# Altium project DistributedMicrocontrollersCopy.PrjPcb
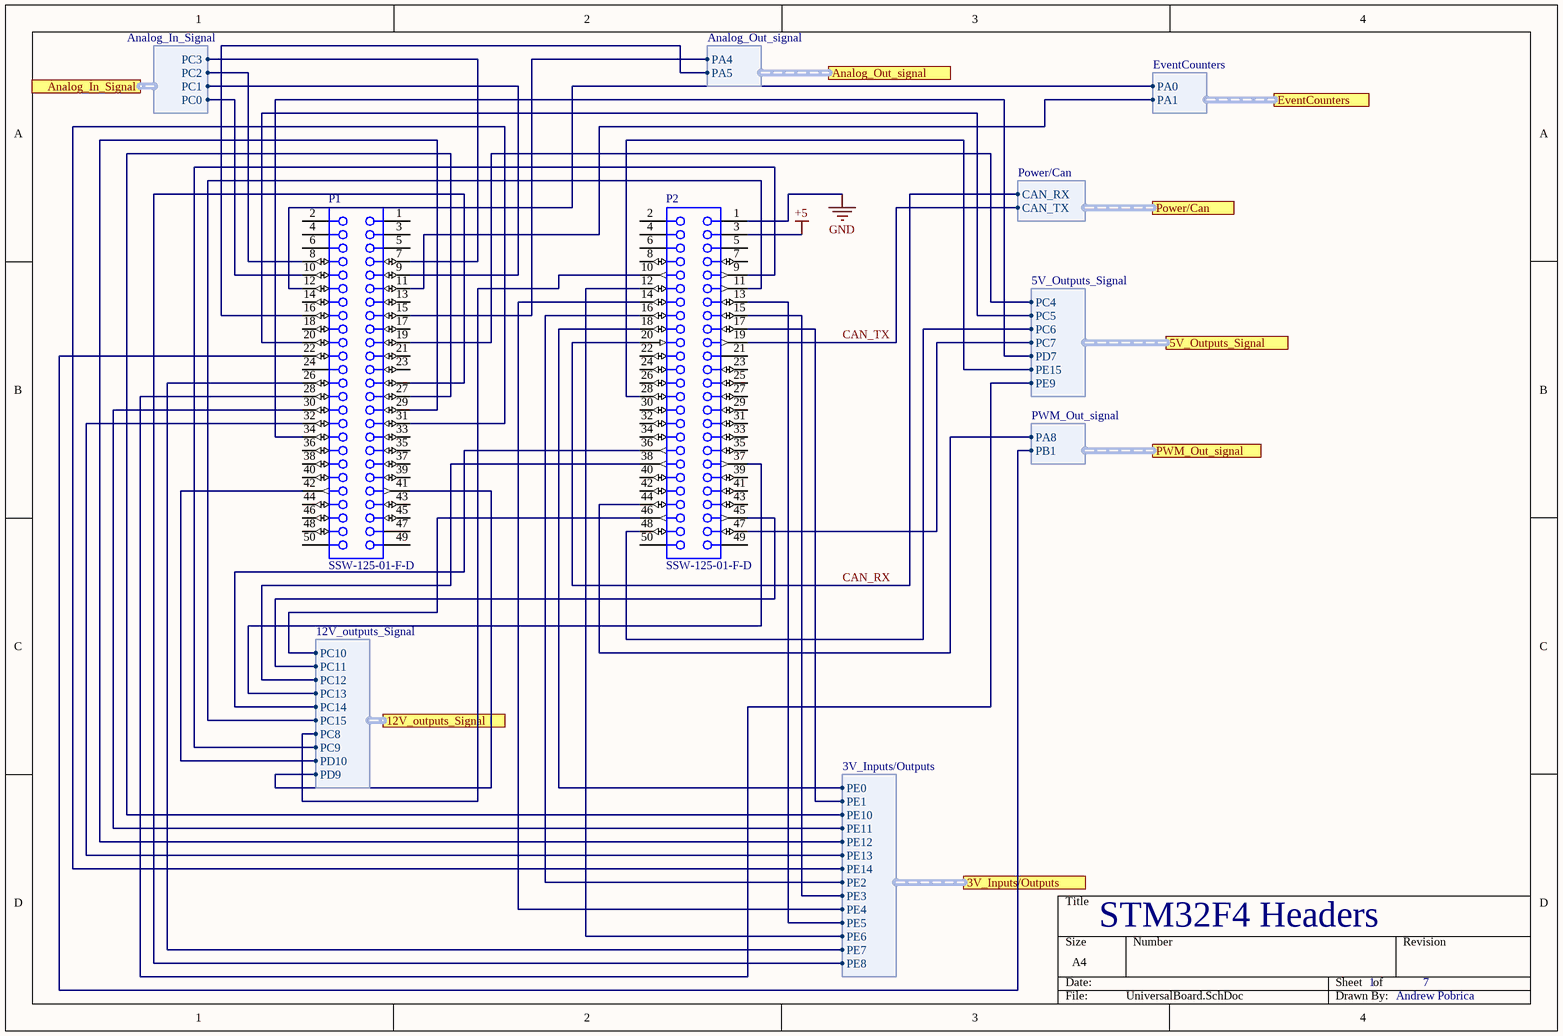
[diagram p0: UniversalBoard.SchDoc]
7 sheets, 75 parts. Net scope: flat (ports and power ports of the same name join across sheets).
Board file: UniversalBoard.PcbDoc
Sheets:
  UniversalBoard.SchDoc
  12vOutputs.SchDoc
  output_header.SchDoc
  Power_CAN.SchDoc
  5vOutputs.SchDoc
  DAC_PWW_Outputs.SchDoc
  Analog_inputs.SchDoc

## Sheet UniversalBoard.SchDoc: STM32F4 Headers
size A4; Author: Andrew Pobrica; DrawnBy: Andrew Pobrica; DocumentNumber: 1; SheetNumber: 1; SheetTotal: 7

### Parts
P1  SSW-125-01-F-D  [SMTC-SSW-125-01-X-D]
P2  SSW-125-01-F-D  [SMTC-SSW-125-01-X-D]

### Ports
3V_Inputs/Outputs (harness 3V_Inputs/Outputs), 5V_Outputs_Signal (harness 5V_Outputs_Signal), 12V_outputs_Signal (harness 12V_outputs_Signal), Analog_In_Signal (harness Analog_In_Signal), Analog_Out_signal (harness Analog_Out_signal), EventCounters (harness EventCounters), Power/Can (harness Power/Can), PWM_Out_signal (harness PWM_Out_signal)

### Harnesses
Power/Can: CAN_RX, CAN_TX
PWM_Out_signal: PA8, PB1
5V_Outputs_Signal: PC4, PC5, PC6, PC7, PD7, PE15, PE9
Analog_In_Signal: PC0, PC1, PC2, PC3
12V_outputs_Signal: PC10, PC11, PC12, PC13, PC14, PC15, PC8, PC9, PD10, PD9
Analog_Out_signal: PA4, PA5
3V_Inputs/Outputs: PE0, PE1, PE10, PE11, PE12, PE13, PE14, PE2, PE3, PE4, PE5, PE6, PE7, PE8
EventCounters: PA0, PA1

### Nets
+5: P2.3(5V)
GND: P2.1(GND)
CAN_RX: P2.20(PB8) ; port Power/Can.CAN_RX
CAN_TX: P2.19(PB9) ; port Power/Can.CAN_TX
NetP1_7: P1.7(PC0) ; port Analog_In_Signal.PC3
NetP1_8: P1.8(PC1) ; port Analog_In_Signal.PC2
NetP1_9: P1.9(PC2) ; port Analog_In_Signal.PC1
NetP1_10: P1.10(PC3) ; port Analog_In_Signal.PC0
NetP1_11: P1.11(PA0) ; port EventCounters.PA1
NetP1_12: P1.12(PA1) ; port EventCounters.PA0
NetP1_15: P1.15(PA4) ; port Analog_Out_signal.PA4
NetP1_16: P1.16(PA5) ; port Analog_Out_signal.PA5
NetP1_19: P1.19(PC4) ; port 5V_Outputs_Signal.PC4
NetP1_20: P1.20(PC5) ; port 5V_Outputs_Signal.PC5
NetP1_22: P1.22(PB1) ; port PWM_Out_signal.PB1
NetP1_25: P1.25(PE8) ; port 3V_Inputs/Outputs.PE8
NetP1_26: P1.26(PE7) ; port 3V_Inputs/Outputs.PE7
NetP1_27: P1.27(PE10) ; port 3V_Inputs/Outputs.PE10
NetP1_28: P1.28(PE9) ; port 5V_Outputs_Signal.PE9
NetP1_29: P1.29(PE12) ; port 3V_Inputs/Outputs.PE12
NetP1_30: P1.30(PE11) ; port 3V_Inputs/Outputs.PE11
NetP1_31: P1.31(PE14) ; port 3V_Inputs/Outputs.PE14
NetP1_32: P1.32(PE13) ; port 3V_Inputs/Outputs.PE13
NetP1_34: P1.34(PE15) ; port 5V_Outputs_Signal.PD7
NetP1_41: P1.41(PD10) ; port 12V_outputs_Signal.PD9
NetP1_42: P1.42(PD9) ; port 12V_outputs_Signal.PD10
NetP2_9: P2.9(PC15) ; port 12V_outputs_Signal.PC9
NetP2_10: P2.10(PC14) ; port 12V_outputs_Signal.PC8
NetP2_11: P2.11(PC13) ; port 12V_outputs_Signal.PC15
NetP2_12: P2.12(PE6) ; port 3V_Inputs/Outputs.PE6
NetP2_13: P2.13(PE5) ; port 3V_Inputs/Outputs.PE5
NetP2_14: P2.14(PE4) ; port 3V_Inputs/Outputs.PE4
NetP2_15: P2.15(PE3) ; port 3V_Inputs/Outputs.PE3
NetP2_16: P2.16(PE2) ; port 3V_Inputs/Outputs.PE2
NetP2_17: P2.17(PE1) ; port 3V_Inputs/Outputs.PE1
NetP2_18: P2.18(PE0) ; port 3V_Inputs/Outputs.PE0
NetP2_28: P2.28(PD7) ; port 5V_Outputs_Signal.PE15
NetP2_36: P2.36(PC12) ; port 12V_outputs_Signal.PC14
NetP2_37: P2.37(PC11) ; port 12V_outputs_Signal.PC13
NetP2_38: P2.38(PC10) ; port 12V_outputs_Signal.PC12
NetP2_44: P2.44(PA8) ; port PWM_Out_signal.PA8
NetP2_45: P2.45(PC9) ; port 12V_outputs_Signal.PC11
NetP2_46: P2.46(PC8) ; port 12V_outputs_Signal.PC10
NetP2_47: P2.47(PC7) ; port 5V_Outputs_Signal.PC7
NetP2_48: P2.48(PC6) ; port 5V_Outputs_Signal.PC6

Not connected (* = marked no-connect by the designer): P1 1(GND) 2(GND) 3(VDD) 4(VDD) 5(NRST) 6(GND) 13(PA2) 14(PA3) 17(PA6) 18(PA7) 21(PB0) 23(PB2) 24(GND) 33(PB10) 35(PB12) 36(PB11) 37(PB14) 38(PB13) 39(PD8) 40(PB15) 43(PD12) 44(PD11) 45(PD14) 46(PD13) 47(NC) 48(PD15) 49(GND) 50(GND); P2 2(GND) 4(5V) 5(3V) 6(3V) 7(PH1) 8(PH0) 21(VDD) 22(BOOT0) 23(PB7) 24(PB6) 25(PB5) 26(PB4) 27(PB3) 29(PD6) 30(PD5) 31(PD4) 32(PD3) 33(PD2) 34(PD1) 35(PD0) 39(PA15) 40(PA14) 41(PA13) 42(PA10) 43(PA9) 49(GND) 50(GND)

### Library data of the parts
P1 P2 = CMP-1023-00476-1: SQ Post Socket, Through-hole, Vertical, -55 to 125 degC, 2.54 mm Pitch, 50-Pin, Female, RoHS; Manufacturer: Samtec; Pitch: 2.54 mm; PackageReference: SSW-125-01-X-D; RoHS: True; ComponentLink1Description: Manufacturer URL; Temperature Range: -55 to 125 degC; ComponentLink3URL: http://www.samtec.com/documents/webfiles/cpdf/SSW-1XX-XX-XXX-X-XX-XXX-XX-MKT.pdf; ComponentLink2URL: http://www.samtec.com/documents/webfiles/pdf/SSW_TH.PDF; PartNumber: SSW-125-01-F-D; PackageDescription: Assembly, Socket Strip .016 X .031 Tail; ComponentLink1URL: http://www.samtec.com; DatasheetVersion: F-214; PackageVersion: CA, 6/1987; ComponentLink2Description: Datasheet; Mounting Technology: Through-hole; Orientation: Vertical; ComponentLink3Description: Package Specification

## Sheet 12vOutputs.SchDoc: 12V Outputs
size A; DrawnBy: Andrew Pobrica; DocumentNumber: 2; SheetNumber: 2; SheetTotal: 7
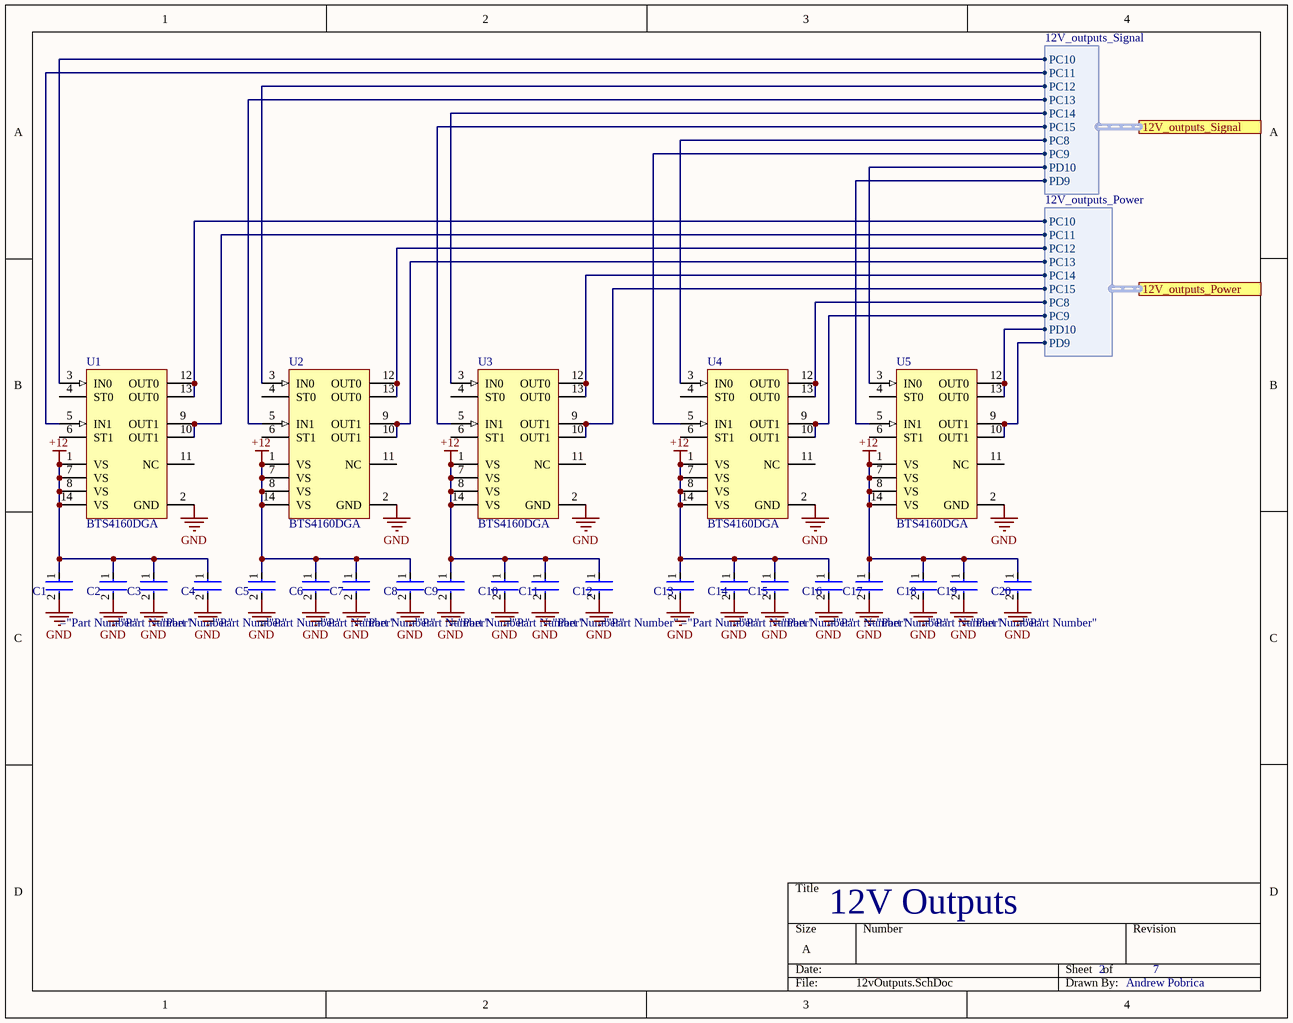
[diagram p1: 12vOutputs.SchDoc]

### Parts
C1  C0603C104K5RACTU  [Kemet_C0805_IPC_A]  (value not drawn)
C2  C0603C104K5RACTU  [Kemet_C0805_IPC_A]  (value not drawn)
C3  C0603C104K5RACTU  [Kemet_C0805_IPC_A]  (value not drawn)
C4  C0603C104K5RACTU  [Kemet_C0805_IPC_A]  (value not drawn)
C5  C0603C104K5RACTU  [Kemet_C0805_IPC_A]  (value not drawn)
C6  C0603C104K5RACTU  [Kemet_C0805_IPC_A]  (value not drawn)
C7  C0603C104K5RACTU  [Kemet_C0805_IPC_A]  (value not drawn)
C8  C0603C104K5RACTU  [Kemet_C0805_IPC_A]  (value not drawn)
C9  C0603C104K5RACTU  [Kemet_C0805_IPC_A]  (value not drawn)
C10  C0603C104K5RACTU  [Kemet_C0805_IPC_A]  (value not drawn)
C11  C0603C104K5RACTU  [Kemet_C0805_IPC_A]  (value not drawn)
C12  C0603C104K5RACTU  [Kemet_C0805_IPC_A]  (value not drawn)
C13  C0603C104K5RACTU  [Kemet_C0805_IPC_A]  (value not drawn)
C14  C0603C104K5RACTU  [Kemet_C0805_IPC_A]  (value not drawn)
C15  C0603C104K5RACTU  [Kemet_C0805_IPC_A]  (value not drawn)
C16  C0603C104K5RACTU  [Kemet_C0805_IPC_A]  (value not drawn)
C17  C0603C104K5RACTU  [Kemet_C0805_IPC_A]  (value not drawn)
C18  C0603C104K5RACTU  [Kemet_C0805_IPC_A]  (value not drawn)
C19  C0603C104K5RACTU  [Kemet_C0805_IPC_A]  (value not drawn)
C20  C0603C104K5RACTU  [Kemet_C0805_IPC_A]  (value not drawn)
U1  BTS4160DGA  [INF-PG-DSO-14-37_N]
U2  BTS4160DGA  [INF-PG-DSO-14-37_N]
U3  BTS4160DGA  [INF-PG-DSO-14-37_N]
U4  BTS4160DGA  [INF-PG-DSO-14-37_N]
U5  BTS4160DGA  [INF-PG-DSO-14-37_N]

### Ports
12V_outputs_Power (harness 12V_outputs_Power), 12V_outputs_Signal (harness 12V_outputs_Signal)

### Harnesses
12V_outputs_Power: PC10, PC11, PC12, PC13, PC14, PC15, PC8, PC9, PD10, PD9
12V_outputs_Signal: PC10, PC11, PC12, PC13, PC14, PC15, PC8, PC9, PD10, PD9

### Nets
+12: C1.1 C2.1 C3.1 C4.1 C5.1 C6.1 C7.1 C8.1 C9.1 C10.1 C11.1 C12.1 C13.1 C14.1 C15.1 C16.1 C17.1 C18.1 C19.1 C20.1 U1.1(VS) U1.7(VS) U1.8(VS) U1.14(VS) U2.1(VS) U2.7(VS) U2.8(VS) U2.14(VS) U3.1(VS) U3.7(VS) U3.8(VS) U3.14(VS) U4.1(VS) U4.7(VS) U4.8(VS) U4.14(VS) U5.1(VS) U5.7(VS) U5.8(VS) U5.14(VS)
GND: C1.2 C2.2 C3.2 C4.2 C5.2 C6.2 C7.2 C8.2 C9.2 C10.2 C11.2 C12.2 C13.2 C14.2 C15.2 C16.2 C17.2 C18.2 C19.2 C20.2 U1.2(GND) U2.2(GND) U3.2(GND) U4.2(GND) U5.2(GND)
NetP1_41: U5.5(IN1) ; port 12V_outputs_Signal.PD9
NetP1_42: U5.3(IN0) ; port 12V_outputs_Signal.PD10
NetP2_9: U4.5(IN1) ; port 12V_outputs_Signal.PC9
NetP2_10: U4.3(IN0) ; port 12V_outputs_Signal.PC8
NetP2_11: U3.5(IN1) ; port 12V_outputs_Signal.PC15
NetP2_36: U3.3(IN0) ; port 12V_outputs_Signal.PC14
NetP2_37: U2.5(IN1) ; port 12V_outputs_Signal.PC13
NetP2_38: U2.3(IN0) ; port 12V_outputs_Signal.PC12
NetP2_45: U1.5(IN1) ; port 12V_outputs_Signal.PC11
NetP2_46: U1.3(IN0) ; port 12V_outputs_Signal.PC10
NetP3_2: U1.9(OUT1) U1.10(OUT1) ; port 12V_outputs_Power.PC11
NetP3_3: U2.9(OUT1) U2.10(OUT1) ; port 12V_outputs_Power.PC13
NetP3_4: U3.9(OUT1) U3.10(OUT1) ; port 12V_outputs_Power.PC15
NetP3_5: U4.9(OUT1) U4.10(OUT1) ; port 12V_outputs_Power.PC9
NetP3_6: U5.9(OUT1) U5.10(OUT1) ; port 12V_outputs_Power.PD9
NetP3_36: U1.12(OUT0) U1.13(OUT0) ; port 12V_outputs_Power.PC10
NetP3_37: U2.12(OUT0) U2.13(OUT0) ; port 12V_outputs_Power.PC12
NetP3_38: U3.12(OUT0) U3.13(OUT0) ; port 12V_outputs_Power.PC14
NetP3_39: U4.12(OUT0) U4.13(OUT0) ; port 12V_outputs_Power.PC8
NetP3_40: U5.12(OUT0) U5.13(OUT0) ; port 12V_outputs_Power.PD10

Not connected (* = marked no-connect by the designer): U1 4(ST0) 6(ST1) 11(NC); U2 4(ST0) 6(ST1) 11(NC); U3 4(ST0) 6(ST1) 11(NC); U4 4(ST0) 6(ST1) 11(NC); U5 4(ST0) 6(ST1) 11(NC)

### Library data of the parts
U1-U5 = BTS4160DGA: Smart High-Side Power Switch, 2 Channels, 1.7 A Load Current, -40 to 150 degC, PG-DSO-14-37, Reel, Green; Manufacturer: Infineon; Group: Automotive Qualified; RON(max) @ 150degreesC: 320 mOhm; Recommended Operating Voltage Min.: 5.5 V; Recommended Operating Voltage Max.: 20 V; Green: TRUE; toff (max): 270 us; Load Current (typ): 1.7 A; ton (max): 250 us; RON @ 25degreesC: 160 mOhm; Ptot (max): 1.4 W; Channels: 2; PartNumber: BTS4160DGA; ComponentLink1Description: Manufacturer URL; ComponentLink2Description: Datasheet; DatasheetVersion: Rev. 1.0; ComponentLink3URL: http://www.infineon.com/dgdl/BTS723GWDS11_2007_09_25.pdf?folderId=db3a304314dca389011537739e37155f&fileId=db3a304331c8f8560131dbfec21b0da9&sId=db3a30443d67b5ca013d854df2f133e5; ComponentLink1URL: http://www.infineon.com/; Packing: Reel; ComponentLink2URL: http://www.infineon.com/dgdl/BTS+4160DGA_DS2008_03_18_neu.pdf?folderId=db3a304314dca389011537739e37155f&fileId=db3a30431a5c32f2011a957ab5875685&sId=db3a30433d68e984013d7cba76cc57cb; ComponentLink3Description: Package Specification; PackageVersion: Sep-07; Halogen-free: TRUE; Mounting Technology: Surface Mount; PackageReference: PG-DSO-14-37; PackageDescription: 14-Pin Plastic (Green) Dual Small Outline Package, 8.65 x 3.9 mm Body, 1.27 mm Pitch

## Sheet output_header.SchDoc: Output Header
size A; DrawnBy: Andrew Pobrica; DocumentNumber: 3; SheetNumber: 3; SheetTotal: 7
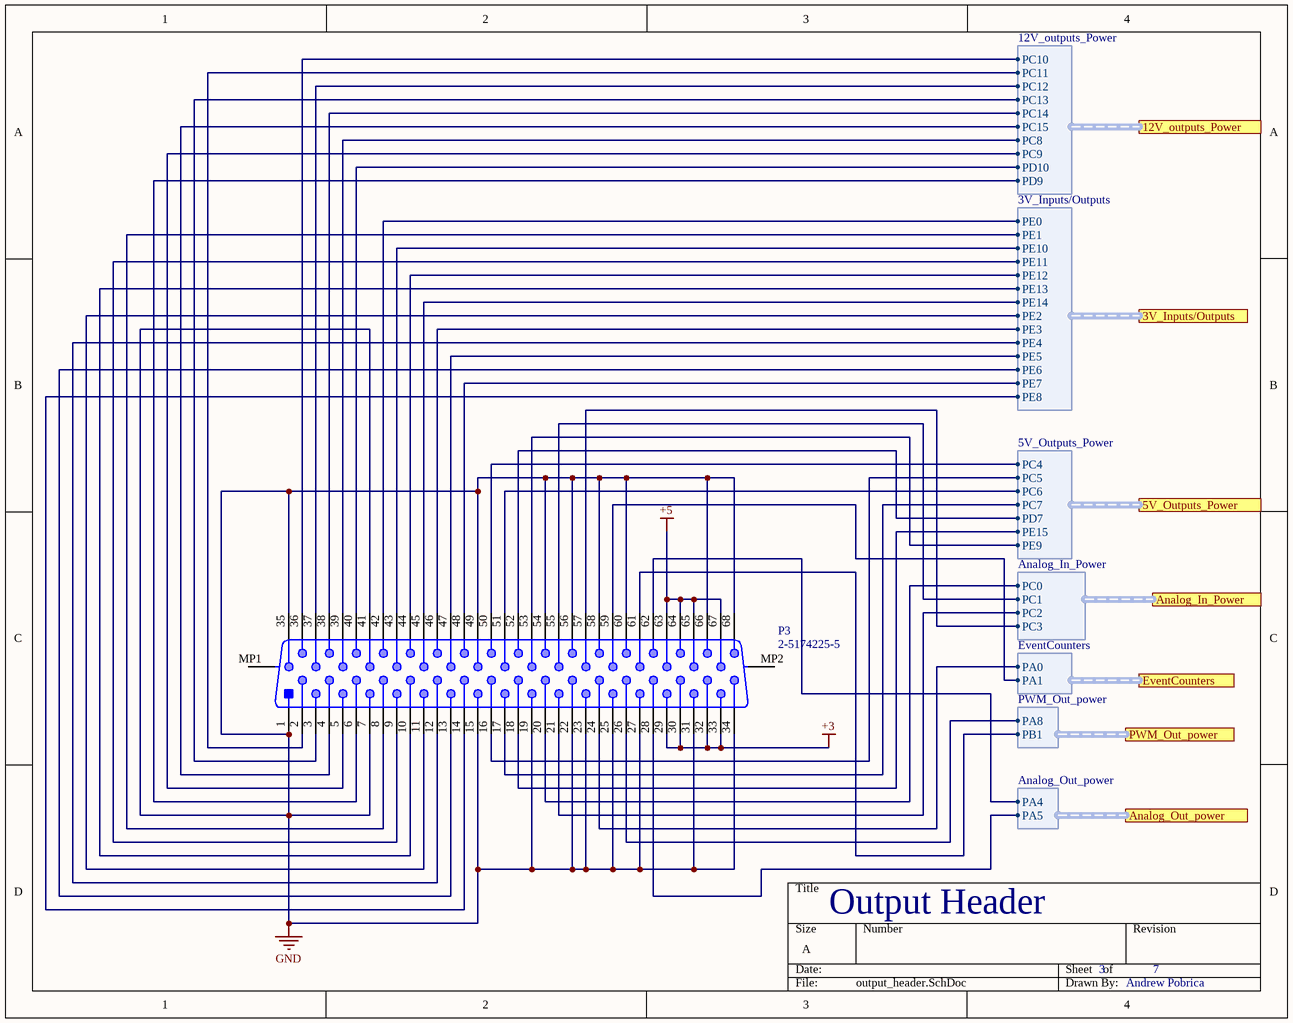
[diagram p2: output_header.SchDoc]

### Parts
P3  2-5174225-5  [TECO-2-5174225-5-68_V]

### Ports
3V_Inputs/Outputs (harness 3V_Inputs/Outputs), 5V_Outputs_Power (harness 5V_Outputs_Power), 12V_outputs_Power (harness 12V_outputs_Power), Analog_In_Power (harness Analog_In_Power), Analog_Out_power (harness Analog_Out_power), EventCounters (harness EventCounters), PWM_Out_power (harness PWM_Out_power)

### Harnesses
12V_outputs_Power: PC10, PC11, PC12, PC13, PC14, PC15, PC8, PC9, PD10, PD9
5V_Outputs_Power: PC4, PC5, PC6, PC7, PD7, PE15, PE9
EventCounters: PA0, PA1
3V_Inputs/Outputs: PE0, PE1, PE10, PE11, PE12, PE13, PE14, PE2, PE3, PE4, PE5, PE6, PE7, PE8
Analog_In_Power: PC0, PC1, PC2, PC3
PWM_Out_power: PA8, PB1
Analog_Out_power: PA4, PA5

### Nets
+3: P3.29 P3.30 P3.32 P3.33
+5: P3.63 P3.64 P3.65 P3.67
GND: P3.1 P3.7 P3.15 P3.19 P3.22 P3.23 P3.25 P3.27 P3.31 P3.34 P3.35 P3.41 P3.49 P3.54 P3.56 P3.58 P3.60 P3.66 P3.68
NetP1_11: P3.59 ; port EventCounters.PA1
NetP1_12: P3.24 ; port EventCounters.PA0
NetP1_25: P3.14 ; port 3V_Inputs/Outputs.PE8
NetP1_26: P3.48 ; port 3V_Inputs/Outputs.PE7
NetP1_27: P3.43 ; port 3V_Inputs/Outputs.PE10
NetP1_29: P3.44 ; port 3V_Inputs/Outputs.PE12
NetP1_30: P3.9 ; port 3V_Inputs/Outputs.PE11
NetP1_31: P3.45 ; port 3V_Inputs/Outputs.PE14
NetP1_32: P3.10 ; port 3V_Inputs/Outputs.PE13
NetP2_12: P3.13 ; port 3V_Inputs/Outputs.PE6
NetP2_13: P3.47 ; port 3V_Inputs/Outputs.PE5
NetP2_14: P3.12 ; port 3V_Inputs/Outputs.PE4
NetP2_15: P3.46 ; port 3V_Inputs/Outputs.PE3
NetP2_16: P3.11 ; port 3V_Inputs/Outputs.PE2
NetP2_17: P3.8 ; port 3V_Inputs/Outputs.PE1
NetP2_18: P3.42 ; port 3V_Inputs/Outputs.PE0
NetP3_2: P3.2 ; port 12V_outputs_Power.PC11
NetP3_3: P3.3 ; port 12V_outputs_Power.PC13
NetP3_4: P3.4 ; port 12V_outputs_Power.PC15
NetP3_5: P3.5 ; port 12V_outputs_Power.PC9
NetP3_6: P3.6 ; port 12V_outputs_Power.PD9
NetP3_16: P3.16 ; port 5V_Outputs_Power.PC5
NetP3_17: P3.17 ; port 5V_Outputs_Power.PC7
NetP3_18: P3.18 ; port 5V_Outputs_Power.PE15
NetP3_20: P3.20 ; port Analog_In_Power.PC0
NetP3_21: P3.21 ; port Analog_In_Power.PC2
NetP3_26: P3.26 ; port PWM_Out_power.PA8
NetP3_28: P3.28 ; port Analog_Out_power.PA5
NetP3_36: P3.36 ; port 12V_outputs_Power.PC10
NetP3_37: P3.37 ; port 12V_outputs_Power.PC12
NetP3_38: P3.38 ; port 12V_outputs_Power.PC14
NetP3_39: P3.39 ; port 12V_outputs_Power.PC8
NetP3_40: P3.40 ; port 12V_outputs_Power.PD10
NetP3_50: P3.50 ; port 5V_Outputs_Power.PC4
NetP3_51: P3.51 ; port 5V_Outputs_Power.PC6
NetP3_52: P3.52 ; port 5V_Outputs_Power.PD7
NetP3_53: P3.53 ; port 5V_Outputs_Power.PE9
NetP3_55: P3.55 ; port Analog_In_Power.PC1
NetP3_57: P3.57 ; port Analog_In_Power.PC3
NetP3_61: P3.61 ; port PWM_Out_power.PB1
NetP3_62: P3.62 ; port Analog_Out_power.PA4

Not connected (* = marked no-connect by the designer): P3 MP1 MP2

### Library data of the parts
P3 = CMP-2000-05410-1: Male D-Sub Connector, Pitch 1.27 mm, 2 x 34 Position, Height 10.3 mm, Tail Length 2.1 mm, -55 to 85 degC, RoHS, Tray; Manufacturer: TE Connectivity; Other Names: A33476; Featured Product: AMPLIMITED-SubminiatureConnectors; 3D Model: 2-5174225-5.pdf; Flange Feature: Housing/Shell(M2.5);Latchblocks; Voltage Rating: 100V; Product Training Modules: AMPLIMITED-SubConnectors; Dynamic Catalog: AMPLIMITE.050IISeries; Connector Type: Cap,MalePins; Connector Style: D-Type; Number of Positions: 68; Current Rating: 1A; Package Version: Rev. C1, 03/2011; Manufacturer URL: http://www.te.com/; Termination: Solder; Datasheet URL: http://www.te.com.cn/commerce/DocumentDelivery/DDEController?Action=showdoc&DocId=Customer+Drawing%7F5174225%7FC1%7Fpdf%7FEnglish%7FENG_CD_5174225_C1.pdf%7F2-5174225-5; Category: Connectors,Interconnects; Series: AMPLIMITE.050II; Shell Material, Finish: Zinc,NickelPlated; Housing Material: PolybutyleneTerephthalate(PBT); Family: D-SubConnectors; Package Reference: 2-5174225-5-68; Package URL: http://www.te.com.cn/commerce/DocumentDelivery/DDEController?Action=showdoc&DocId=Customer+Drawing%7F5174225%7FC1%7Fpdf%7FEnglish%7FENG_CD_5174225_C1.pdf%7F2-5174225-5; Contact Type: Signal; Number of Rows: 2; Contact Finish Thickness: 30µin(0.76µm); Package Description: Male D-Sub Connector, Pitch 1.27 mm, 2 x 34 Position, Height 10.3 mm, Tail Length 2.1 mm; Color: Black; RoHS Information: 2-5174225-5StatementofCompliance; Datasheet Version: Rev. C1, 03/2011; Shell Size, Connector Layout: 0.050Pitchx0.100RowtoRow; Mounting Type: ThroughHole,RightAngle; Operating Temperature: -55degC~85degC; Contact Finish: Gold; Features: Shielded; Standard Package: 4

## Sheet Power_CAN.SchDoc: Power and CAN
size A; DrawnBy: Andrew Pobrica; DocumentNumber: 4; SheetNumber: 4; SheetTotal: 7
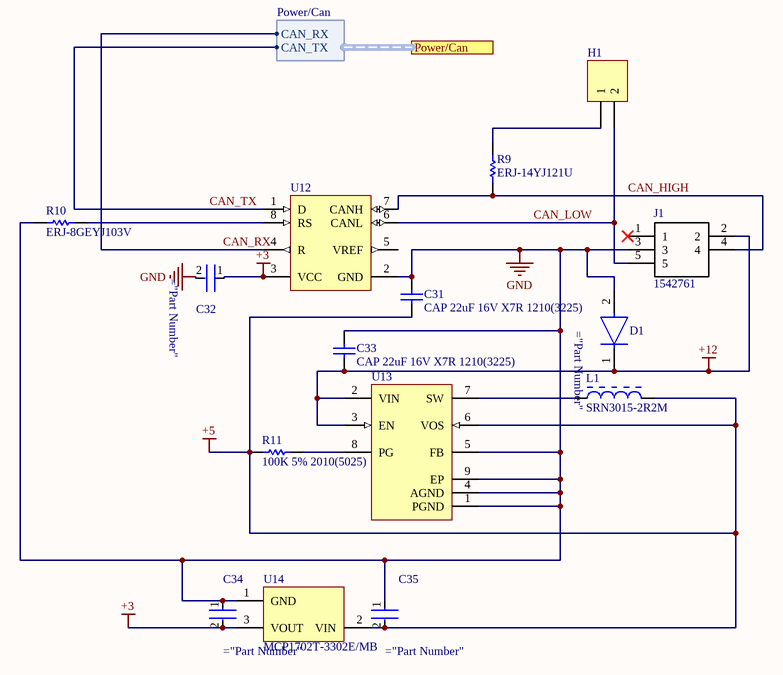
[diagram p3: Power_CAN.SchDoc]

### Parts
C31  CAP 22uF 16V X7R 1210(3225)  [CAPC1210(3225)280_L]
C32  C0603C104K5RACTU  [Kemet_C0805_IPC_A]  (value not drawn)
C33  CAP 22uF 16V X7R 1210(3225)  [CAPC1210(3225)280_L]
C34  C0805C105K4RACTU  [Kemet_C0805_IPC_A]  (value not drawn)
C35  C0805C105K4RACTU  [Kemet_C0805_IPC_A]  (value not drawn)
D1  S1J-13-F  [Diodes_SMA_0]  (value not drawn)
H1  Header 0  [HDR1X2]  (value not drawn)
J1  1542761  [1542761]
L1  SRN3015-2R2M  [BOUR-SRN3015-2_V]
R9  ERJ-14YJ121U  [RESC3225X70X50ML20T20]
R10  ERJ-8GEYJ103V  [RESC3216X70X50NL05T20]
R11  100K 5% 2010(5025)  [RESC2010(5025)_L]
U12  SN65HVD230D  [D0008A_M]  (value not drawn)
U13  TPS62173DSGR  [DSG8-1600X900TP]  (value not drawn)
U14  MCP1702T-3302E/MB  [SOT-89-MB3_N]

### Ports
Power/Can (harness Power/Can)

### Harnesses
Power/Can: CAN_RX, CAN_TX

### Nets
+3: C32.1 C34.2 U12.3(VCC) U14.3(VOUT)
+5: C31.1 C35.2 L1.2 R11.1 U13.6(VOS) U14.2(VIN)
+12: C33.1 D1.1(C) J1.2 U13.2(VIN) U13.3(EN)
GND: C31.2 C32.2 C33.2 C34.1 C35.1 D1.2(A) J1.3 R10.2 U12.2(GND) U13.1(PGND) U13.4(AGND) U13.5(FB) U13.9(EP) U14.1(GND)
CAN_HIGH: J1.4 R9.1 U12.7(CANH)
CAN_LOW: H1.2 J1.5 U12.6(CANL)
CAN_RX: U12.4(R) ; port Power/Can.CAN_RX
CAN_TX: U12.1(D) ; port Power/Can.CAN_TX
NetH1_1: H1.1 R9.2
NetL1_1: L1.1 U13.7(SW)
NetR10_1: R10.1 U12.8(RS)
NetR11_2: R11.2 U13.8(PG)

Not connected (* = marked no-connect by the designer): J1 1*; U12 5(VREF)

### Library data of the parts
C31 C33 = CMP-1038-02277-1: CAP 22uF 16V ±10% 1210 (3225 Metric) Thickness 2.8mm SMD; Case-Metric: 3225; Case-EIA: 1210; Tolerance: Â±10%; Rated Voltage: 16 V; Technology: SMT; Value: 22uF; Max Thickness: 2.8 mm
H1 = Header 2: Header, 2-Pin; LatestRevisionDate: 17-Jul-2002; LatestRevisionNote: Re-released for DXP Platform.; Publisher: Altium Limited
J1 = 1542761: Connector; Manufacturer_Name: Phoenix Contact; Allied_Number: 70170366; Datasheet Link: https://media.digikey.com/PDF/Data%20Sheets/Phoenix%20Contact%20PDFs/1542761.pdf; Height: 18mm; Manufacturer_Part_Number: 1542761; Mouser Part Number: 651-1542761; Mouser Price/Stock: https://www.mouser.com/Search/Refine.aspx?Keyword=651-1542761; RS Part Number: 8025583; RS Price/Stock: http://uk.rs-online.com/web/p/products/8025583; Allied Price/Stock: https://www.alliedelec.com/phoenixcontact-1542761/70170366/
L1 = CMP-0007-00003-1: Semi-shielded Power Inductor, 2.2 uH, +/- 20%, 1.8 A, -40 to 125 degC, 3 x 3 x 1.5 mm SMD, RoHS and Halogen Free, Tape and Reel; Manufacturer: Bourns; Isat: 1.65 A; Rated current: 1.8 A; Inductance: 2.2 uH; Inductance tolerance: +/- 20%; DCR Max: 0.072 Ohm; SRF Min: 90 MHz; Resistance to Solder Heat: +260 degC for 10 sec.; Operating Temperature: -40 to 125 degC; PartNumber: SRN3015-2R2M; Packing: Tape and Reel; ComponentLink3Description: Package Specification; ComponentLink2Description: Datasheet; RoHS: TRUE; ComponentLink3URL: http://www.bourns.com/data/global/pdfs/SRN3015.pdf; PackageDescription: 2-Pin SMD, Body 3 x 3 mm, Height 1.5 mm; ComponentLink1URL: http://www.bourns.com/; ComponentLink1Description: Manufacturer URL; DatasheetVersion: Aug-11; Mounting Technology: Surface Mount; ComponentLink2URL: http://www.bourns.com/data/global/pdfs/SRN3015.pdf; PackageReference: SRN3015
R9 = CMP-2005-03490-1: Manufacturer: Panasonic; Part Number: ERJ-14YJ121U
R10 = CMP-2003-00545-1: Manufacturer: Panasonic; Part Number: ERJ-8GEYJ103V
R11 = CMP-1017-00122-1: 100K 0.75W 5% 2010 (5025 Metric)  SMD; Value: 100000.00 Ohm; Case-Metric: 5025; Case-EIA: 2010; Technology: SMT; Power: 0.75 W; Tolerance: 5 %
U12 = CMP-0315-00046-3: CAN Bus Transceiver, 3.3 V, -40 to 85 degC, 8-Pin SOIC (D), Green (RoHS & no Sb/Br), Tube; Supply Voltage Min: 3 V; Supply Voltage Max: 3.6 V; PartNumber: SN65HVD230D; ComponentLink2URL: http://www.ti.com/general/docs/lit/getliterature.tsp?genericGeneric Part Number=SN65HVD230&fileType=pdf; DatasheetVersion: SLOS346N; Generic Part Number: SN65HVD230; Packing: Tube; Temperature Min: -40 degC; Temperature Max: 85 degC; ComponentLink1Description: Manufacturer URL; Mounting Technology: Surface Mount; RoHS: TRUE; ComponentLink1URL: http://www.ti.com/; ComponentLink2Description: Datasheet; PackageDescription: 8-Pin Plastic Small Outline, Body 4.9 x 3.9 mm, Pitch 1.27 mm
U13 = CMP-0323-00320-3: Buck Step Down Regulator with 3 to 17 V Input and 5 V Output, -40 to 85 degC, 8-Pin WSON (DSG), Green (RoHS & no Sb/Br); Manufacturer: Texas Instruments; Switch Current Limit(Typ)(A): 1.05; Vin(Min)(V): 3; Regulated Outputs(#): 1; Rating: Catalog; Vout(Min)(V): 5; Duty Cycle(Max)(%): 100; SubFamily: Step-Down Regulator; Vin(Max)(V): 17; Iout(Max)(A): 0.5; Synchronous Rectification: TRUE; Iq(Typ)(mA): 0.017; ComponentLink1URL: http://www.ti.com/general/docs/lit/getliterature.tsp?genericPartNumber=TPS62173&fileType=pdf; Code_JEDEC: MO-229; PackageDescription: 8-Pin Plastic Small Outline No-Lead, 2 x 2 x 0.8 mm Body, 0.5 mm Pitch, Exposed Pad; PackageVersion: revB, Oct-2010; Mounting Technology: Surface Mount; PartNumber: TPS62173DSGR; PackageReference: DSG0008A; Topology: Buck; ComponentLink1Description: Datasheet; DatasheetVersion: SLVSAT8A; ComponentLink2Description: Package Specification; Eco-Plan: Green (RoHS & no Sb/Br); Vout(Max)(V): 5; ComponentLink2URL: http://www.ti.com/litv/pdf/mpds308a; ComponentLink3URL: Samples URL:http://www.ti.com/product/tps62173#samples; ComponentLink3Description: URL Link1; Preset Vout(V): 5
U14 = CMP-0136-00852-1: 250 mA Low Quiescent Current LDO Regulator, 3-Pin SOT-89, Extended Temperature, Tape and Reel; Code_IPC: SOT89; DatasheetVersion: revD, Jun-2009; PackageDescription: 3-Lead Plastic Small Outline Transistor Header (MB) [SOT-89]; PackageVersion: revBB, Aug-2009; PackageReference: SOT-89-MB3

## Sheet 5vOutputs.SchDoc: 5V Outputs
size A; DrawnBy: Andrew Pobrica; DocumentNumber: 5; SheetNumber: 5; SheetTotal: 7
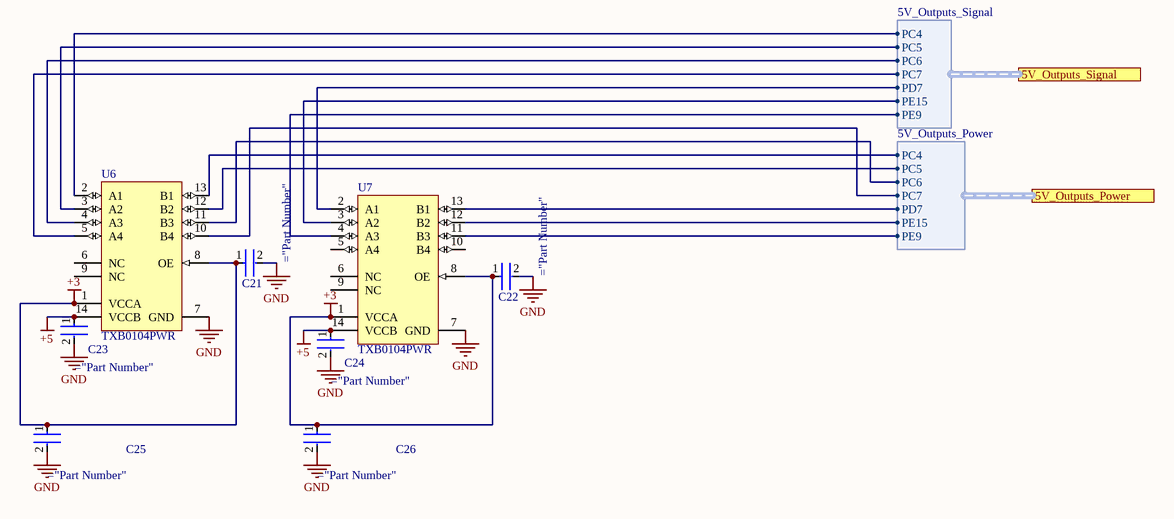
[diagram p4: 5vOutputs.SchDoc]

### Parts
C21  C0603C104K5RACTU  [Kemet_C0805_IPC_A]  (value not drawn)
C22  C0603C104K5RACTU  [Kemet_C0805_IPC_A]  (value not drawn)
C23  C0603C104K5RACTU  [Kemet_C0805_IPC_A]  (value not drawn)
C24  C0603C104K5RACTU  [Kemet_C0805_IPC_A]  (value not drawn)
C25  C0603C104K5RACTU  [Kemet_C0805_IPC_A]  (value not drawn)
C26  C0603C104K5RACTU  [Kemet_C0805_IPC_A]  (value not drawn)
U6  TXB0104PWR  [PW0014A_Custom]
U7  TXB0104PWR  [PW0014A_Custom]

### Ports
5V_Outputs_Power (harness 5V_Outputs_Power), 5V_Outputs_Signal (harness 5V_Outputs_Signal)

### Harnesses
5V_Outputs_Signal: PC4, PC5, PC6, PC7, PD7, PE15, PE9
5V_Outputs_Power: PC4, PC5, PC6, PC7, PD7, PE15, PE9

### Nets
+3: C21.1 C22.1 C25.1 C26.1 U6.1(VCCA) U6.8(OE) U7.1(VCCA) U7.8(OE)
+5: C23.1 C24.1 U6.14(VCCB) U7.14(VCCB)
GND: C21.2 C22.2 C23.2 C24.2 C25.2 C26.2 U6.7(GND) U7.7(GND)
NetP1_19: U6.2(A1) ; port 5V_Outputs_Signal.PC4
NetP1_20: U6.3(A2) ; port 5V_Outputs_Signal.PC5
NetP1_28: U7.4(A3) ; port 5V_Outputs_Signal.PE9
NetP1_34: U7.2(A1) ; port 5V_Outputs_Signal.PD7
NetP2_28: U7.3(A2) ; port 5V_Outputs_Signal.PE15
NetP2_47: U6.5(A4) ; port 5V_Outputs_Signal.PC7
NetP2_48: U6.4(A3) ; port 5V_Outputs_Signal.PC6
NetP3_16: U6.12(B2) ; port 5V_Outputs_Power.PC5
NetP3_17: U6.10(B4) ; port 5V_Outputs_Power.PC7
NetP3_18: U7.12(B2) ; port 5V_Outputs_Power.PE15
NetP3_50: U6.13(B1) ; port 5V_Outputs_Power.PC4
NetP3_51: U6.11(B3) ; port 5V_Outputs_Power.PC6
NetP3_52: U7.13(B1) ; port 5V_Outputs_Power.PD7
NetP3_53: U7.11(B3) ; port 5V_Outputs_Power.PE9

Not connected (* = marked no-connect by the designer): U6 6(NC) 9(NC); U7 5(A4) 6(NC) 9(NC) 10(B4)

### Library data of the parts
U6 U7 = TI-TXB0104-TSSOP_PW-14: 4-Bit Bidirectional Voltage-Level Translator with Automatic Direction Sensing and +/- 15-kV ESD Protection, -40 to 85 degC, 14-Pin TSSOP (PW), Green (RoHS & Sb/Br), Tape and Reel; Manufacturer: Texas Instruments; Dynamic Catalog: TXBSeries; Number of Bits: 4; Voltage - Supply: 1.2V~3.6V,1.65V~5.5V; Other Names: 296-21929-6; Propagation Delay (Max): 4ns; Logic Function: Translator,Bidirectional; Data Rate: 100Mbps; Differential - Input: Output:No/No; Number of Outputs/Channel: 1; Output Type: Logic; Product Training Modules: VoltageLevelTranslation; Number of Channels: 4; Package Reference: PW14; Package Description: 14-Pin Thin Shrink Small Outline Package, Body 5 x 4.4 mm, Pitch 0.65 mm; Datasheet Version: Rev. G, 11/2014; Manufacturer URL: http://www.ti.com/; Series: -; Packaging: Digi-Reel®; Mounting Technology: SurfaceMount; Family: Logic-Translators; Standard Package: 1; Category: IntegratedCircuits(ICs); Supplier Device Package: 14-TSSOP; Datasheet URL: http://www.ti.com/general/docs/lit/getliterature.tsp?genericPartNumber=TXB0104&fileType=pdf; Operating Temperature: -40°C~85°C; Input Type: Logic; Package / Case: 14-TSSOP(0.173",4.40mmWidth)

## Sheet DAC_PWW_Outputs.SchDoc: DAC/PWM Outputs
size A; DrawnBy: Andrew Pobrica; DocumentNumber: 6; SheetNumber: 6; SheetTotal: 7
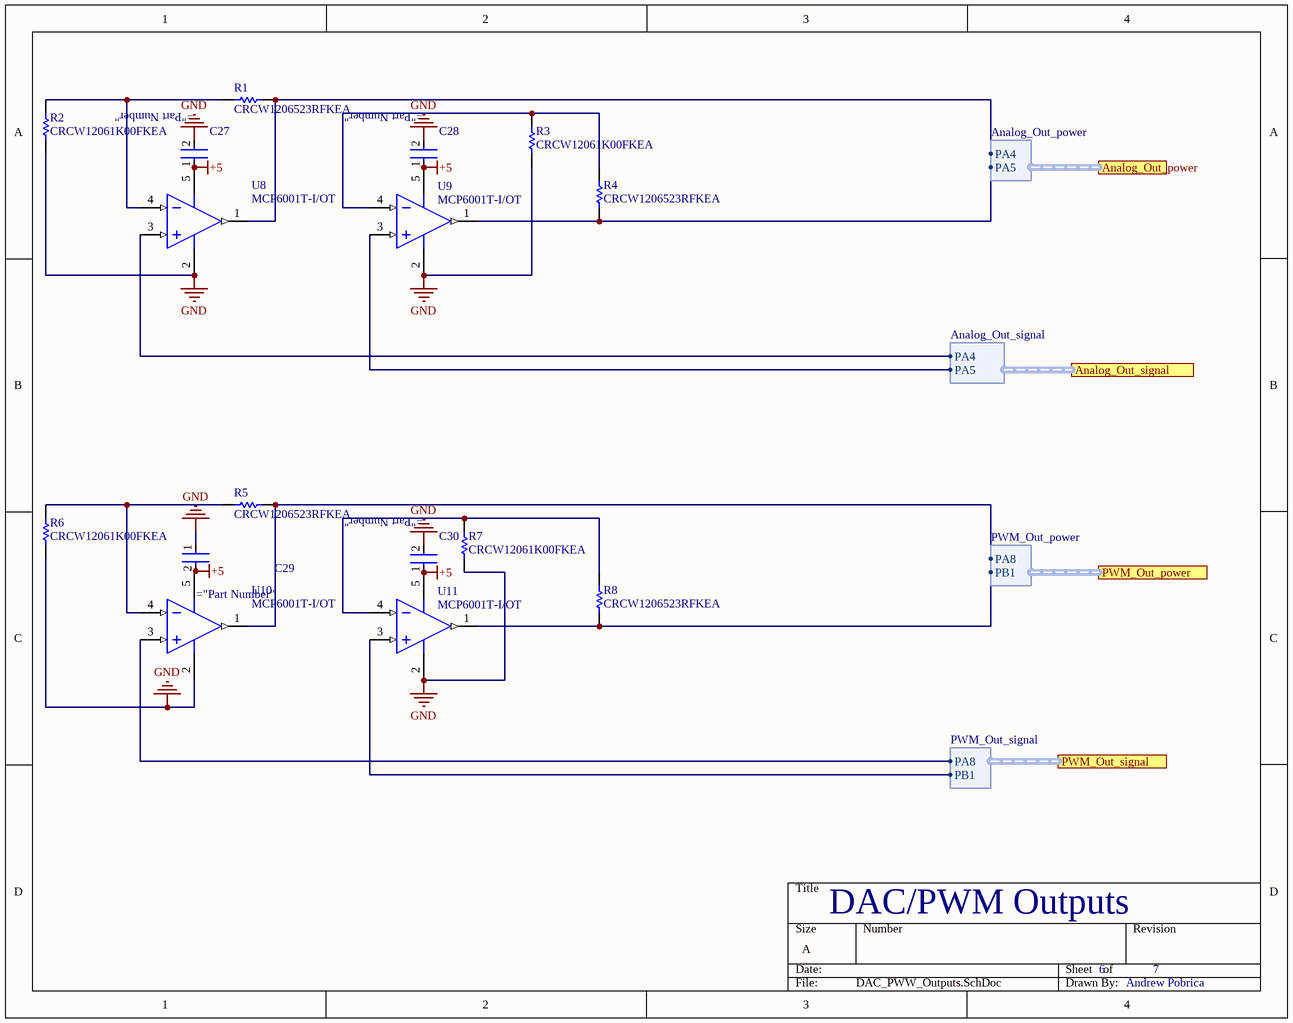
[diagram p5: DAC_PWW_Outputs.SchDoc]

### Parts
C27  C0603C104K5RACTU  [Kemet_C0805_IPC_A]  (value not drawn)
C28  C0603C104K5RACTU  [Kemet_C0805_IPC_A]  (value not drawn)
C29  C0603C104K5RACTU  [Kemet_C0805_IPC_A]  (value not drawn)
C30  C0603C104K5RACTU  [Kemet_C0805_IPC_A]  (value not drawn)
R1  CRCW1206523RFKEA  [RESC3216X60X45NL10T20]
R2  CRCW12061K00FKEA  [RESC3216X60X45ML15T20]
R3  CRCW12061K00FKEA  [RESC3216X60X45ML15T20]
R4  CRCW1206523RFKEA  [RESC3216X60X45NL10T20]
R5  CRCW1206523RFKEA  [RESC3216X60X45NL10T20]
R6  CRCW12061K00FKEA  [RESC3216X60X45ML15T20]
R7  CRCW12061K00FKEA  [RESC3216X60X45ML15T20]
R8  CRCW1206523RFKEA  [RESC3216X60X45NL10T20]
U8  MCP6001T-I/OT  [SOT-23-OT5_CUSTOM]
U9  MCP6001T-I/OT  [SOT-23-OT5_CUSTOM]
U10  MCP6001T-I/OT  [SOT-23-OT5_CUSTOM]
U11  MCP6001T-I/OT  [SOT-23-OT5_CUSTOM]

### Ports
Analog_Out_power (harness Analog_Out_power), Analog_Out_signal (harness Analog_Out_signal), PWM_Out_power (harness PWM_Out_power), PWM_Out_signal (harness PWM_Out_signal)

### Harnesses
Analog_Out_power: PA4, PA5
PWM_Out_signal: PA8, PB1
Analog_Out_signal: PA4, PA5
PWM_Out_power: PA8, PB1

### Nets
+5: C27.1 C28.1 C29.2 C30.1 U8.5(VDD) U9.5(VDD) U10.5(VDD) U11.5(VDD)
GND: C27.2 C28.2 C29.1 C30.2 R2.2 R3.2 R6.2 R7.2 U8.2(VSS) U9.2(VSS) U10.2(VSS) U11.2(VSS)
NetP1_15: U8.3(VIN+) ; port Analog_Out_signal.PA4
NetP1_16: U9.3(VIN+) ; port Analog_Out_signal.PA5
NetP1_22: U11.3(VIN+) ; port PWM_Out_signal.PB1
NetP2_44: U10.3(VIN+) ; port PWM_Out_signal.PA8
NetP3_26: R5.1 U10.1(VOUT) ; port PWM_Out_power.PA8
NetP3_28: R4.1 U9.1(VOUT) ; port Analog_Out_power.PA5
NetP3_61: R8.1 U11.1(VOUT) ; port PWM_Out_power.PB1
NetP3_62: R1.1 U8.1(VOUT) ; port Analog_Out_power.PA4
NetR1_2: R1.2 R2.1 U8.4(VIN-)
NetR3_1: R3.1 R4.2 U9.4(VIN-)
NetR5_2: R5.2 R6.1 U10.4(VIN-)
NetR7_1: R7.1 R8.2 U11.4(VIN-)

### Library data of the parts
R1 R4 R5 R8 = CMP-2003-02266-1: Manufacturer: Vishay Dale; Part Number: CRCW1206523RFKEA
R2 R3 R6 R7 = CMP-2100-03616-1: Chip Resistor, 1 KOhm, +/- 1%, 0.25 W, -55 to 155 degC, 1206 (3216 Metric), RoHS, Tape and Reel; Manufacturer: Vishay Semiconductor; Power Rating: 250mW; Voltage Rating (DC): 200V; Resistance: 1KOhm; Temperature Coefficient: 100ppm/degreesC; Case Code (Imperial): 1206; Length: 3.2mm; Case/Package: 1206; Contact Plating: Tin; Package Quantity: 10; Datasheet URL: http://www.farnell.com/datasheets/1720486.pdf; Mount: SurfaceMount; Package Description: 2-Pin Surface Mount Device, Body 3.15 x 1.6 mm; Package Reference: 1206.0; Max Operating Temperature: 155degC; Lead Free: LeadFree; Weight: 0.000353oz; Military Standard: Not; Max Power Dissipation: 250mW; Case Code (Metric): 3216; Number of Terminations: 2; Tolerance: 1%; Width: 0.063inch; Termination: SMD/SMT; Number of Pins: 2; Min Operating Temperature: -55degC; Height: 0.55mm; Depth: 1.6mm; RoHSCompliant: true; Composition: ThickFilm; Packaging: TapeandReel; Manufacturer URL: http://www.vishay.com/; Voltage Rating: 200V; Radiation Hardening: No; REACH SVHC: Unknown; Datasheet Version: 41061.0
U8 U11 = CMP-0187-00462-2: 1 MHz, Low-Power Operational Amplifier, 5-Pin SOT-23, Industrial Temperature, Tape and Reel; RevisionNote: URLs added.; PackageReference: SOT-23-OT5; ComponentLink1URL: http://www.microchip.com/; DatasheetVersion: revJ, Nov-2009; ComponentLink3URL: http://www.microchip.com/stellent/groups/techpub_sg/documents/packagingspec/en012702.pdf; PackageVersion: revBB, Aug-2009; ComponentLink2Description: Datasheet; ComponentLink3Description: Package Specification; PackageDescription: 5-Lead Plastic Small Outline Transistor (OT) [SOT-23]; ComponentLink2URL: http://ww1.microchip.com/downloads/en/DeviceDoc/21733j.pdf; ComponentLink1Description: Manufacturer URL; Code_IPC: SOT23-5
U9 U10 = AMP-OPA-MCP6001-SOT5: 1 MHz, Low-Power Operational Amplifier, 5-Pin SOT-23, Industrial Temperature, Tape and Reel; RevisionNote: URLs added.; PackageReference: SOT-23-OT5; ComponentLink1URL: http://www.microchip.com/; DatasheetVersion: revJ, Nov-2009; ComponentLink3URL: http://www.microchip.com/stellent/groups/techpub_sg/documents/packagingspec/en012702.pdf; PackageVersion: revBB, Aug-2009; ComponentLink2Description: Datasheet; ComponentLink3Description: Package Specification; PackageDescription: 5-Lead Plastic Small Outline Transistor (OT) [SOT-23]; ComponentLink2URL: http://ww1.microchip.com/downloads/en/DeviceDoc/21733j.pdf; ComponentLink1Description: Manufacturer URL; Code_IPC: SOT23-5

## Sheet Analog_inputs.SchDoc: Analog Inputs
size A; DrawnBy: Andrew Pobrica; DocumentNumber: 7; SheetNumber: 7; SheetTotal: 7
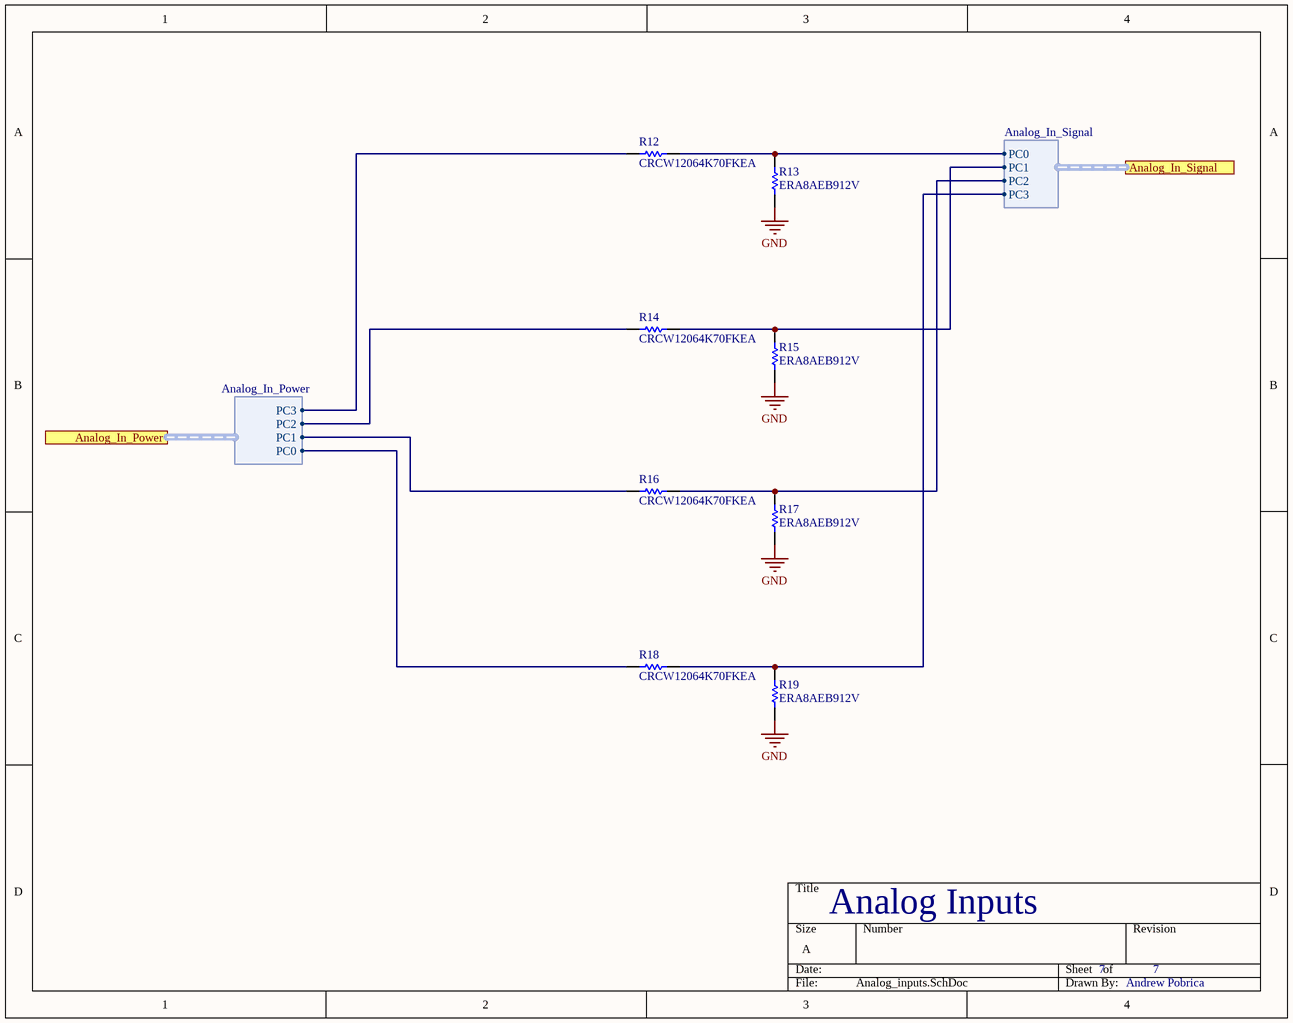
[diagram p6: Analog_inputs.SchDoc]

### Parts
R12  CRCW12064K70FKEA  [RESC3216X60X45ML15T20]
R13  ERA8AEB912V  [RESC3216X70X50ML20T25]
R14  CRCW12064K70FKEA  [RESC3216X60X45ML15T20]
R15  ERA8AEB912V  [RESC3216X70X50ML20T25]
R16  CRCW12064K70FKEA  [RESC3216X60X45ML15T20]
R17  ERA8AEB912V  [RESC3216X70X50ML20T25]
R18  CRCW12064K70FKEA  [RESC3216X60X45ML15T20]
R19  ERA8AEB912V  [RESC3216X70X50ML20T25]

### Ports
Analog_In_Power (harness Analog_In_Power), Analog_In_Signal (harness Analog_In_Signal)

### Harnesses
Analog_In_Signal: PC0, PC1, PC2, PC3
Analog_In_Power: PC0, PC1, PC2, PC3

### Nets
GND: R13.2 R15.2 R17.2 R19.2
NetP1_7: R18.1 R19.1 ; port Analog_In_Signal.PC3
NetP1_8: R16.1 R17.1 ; port Analog_In_Signal.PC2
NetP1_9: R14.1 R15.1 ; port Analog_In_Signal.PC1
NetP1_10: R12.1 R13.1 ; port Analog_In_Signal.PC0
NetP3_20: R18.2 ; port Analog_In_Power.PC0
NetP3_21: R14.2 ; port Analog_In_Power.PC2
NetP3_55: R16.2 ; port Analog_In_Power.PC1
NetP3_57: R12.2 ; port Analog_In_Power.PC3

### Library data of the parts
R12 R14 R16 R18 = CMP-2100-03618-1: Chip Resistor, 4.7 KOhm, +/- 1%, 0.25 W, -55 to 155 degC, 1206 (3216 Metric), RoHS, Tape and Reel; Manufacturer: Vishay Semiconductor; Power Rating: 250mW; Voltage Rating: 200V; Temperature Coefficient: 100ppm/degreesC; Package Quantity: 10; Composition: ThickFilm; REACH SVHC: Unknown; Mount: SurfaceMount; Max Operating Temperature: 155degC; Length: 3.2mm; Number of Terminations: 2; Case Code (Metric): 3216; Military Standard: Not; Width: 1.6mm; Datasheet Version: 41061.0; Max Power Dissipation: 250mW; Datasheet URL: http://www.vishay.com/docs/20035/dcrcwe3.pdf; Contact Plating: Tin; Case/Package: 1206; Height: 0.55mm; Package Reference: 1206.0; Lead Free: LeadFree; Weight: 0.000353oz; Package Description: 2-Pin Surface Mount Device, Body 3.15 x 1.6 mm; Min Operating Temperature: -55degC; Resistance: 4.7KOhm; Packaging: TapeandReel; Depth: 1.6mm; Tolerance: 1%; RoHSCompliant: true; Termination: SMD/SMT; Case Code (Imperial): 1206; Voltage Rating (DC): 200V; Radiation Hardening: No; Manufacturer URL: http://www.vishay.com/
R13 R15 R17 R19 = CMP-2003-00013-1: Manufacturer: Panasonic; Part Number: ERA8AEB912V

## Nets that join several sheets
+3: output_header (P3.29 P3.30 P3.32 P3.33), Power_CAN (C32.1 C34.2 U12.3 U14.3), 5vOutputs (8 pins)
+5: UniversalBoard (P2.3), output_header (P3.63 P3.64 P3.65 P3.67), Power_CAN (6 pins), 5vOutputs (C23.1 C24.1 U6.14 U7.14), DAC_PWW_Outputs (8 pins)
+12: 12vOutputs (40 pins), Power_CAN (5 pins)
GND: UniversalBoard (P2.1), 12vOutputs (25 pins), output_header (19 pins), Power_CAN (14 pins), 5vOutputs (8 pins), DAC_PWW_Outputs (12 pins), Analog_inputs (R13.2 R15.2 R17.2 R19.2)
CAN_RX: UniversalBoard (P2.20), Power_CAN (U12.4)
CAN_TX: UniversalBoard (P2.19), Power_CAN (U12.1)
NetP1_7: UniversalBoard (P1.7), Analog_inputs (R18.1 R19.1)
NetP1_8: UniversalBoard (P1.8), Analog_inputs (R16.1 R17.1)
NetP1_9: UniversalBoard (P1.9), Analog_inputs (R14.1 R15.1)
NetP1_10: UniversalBoard (P1.10), Analog_inputs (R12.1 R13.1)
NetP1_11: UniversalBoard (P1.11), output_header (P3.59)
NetP1_12: UniversalBoard (P1.12), output_header (P3.24)
NetP1_15: UniversalBoard (P1.15), DAC_PWW_Outputs (U8.3)
NetP1_16: UniversalBoard (P1.16), DAC_PWW_Outputs (U9.3)
NetP1_19: UniversalBoard (P1.19), 5vOutputs (U6.2)
NetP1_20: UniversalBoard (P1.20), 5vOutputs (U6.3)
NetP1_22: UniversalBoard (P1.22), DAC_PWW_Outputs (U11.3)
NetP1_25: UniversalBoard (P1.25), output_header (P3.14)
NetP1_26: UniversalBoard (P1.26), output_header (P3.48)
NetP1_27: UniversalBoard (P1.27), output_header (P3.43)
NetP1_28: UniversalBoard (P1.28), 5vOutputs (U7.4)
NetP1_29: UniversalBoard (P1.29), output_header (P3.44)
NetP1_30: UniversalBoard (P1.30), output_header (P3.9)
NetP1_31: UniversalBoard (P1.31), output_header (P3.45)
NetP1_32: UniversalBoard (P1.32), output_header (P3.10)
NetP1_34: UniversalBoard (P1.34), 5vOutputs (U7.2)
NetP1_41: UniversalBoard (P1.41), 12vOutputs (U5.5)
NetP1_42: UniversalBoard (P1.42), 12vOutputs (U5.3)
NetP2_9: UniversalBoard (P2.9), 12vOutputs (U4.5)
NetP2_10: UniversalBoard (P2.10), 12vOutputs (U4.3)
NetP2_11: UniversalBoard (P2.11), 12vOutputs (U3.5)
NetP2_12: UniversalBoard (P2.12), output_header (P3.13)
NetP2_13: UniversalBoard (P2.13), output_header (P3.47)
NetP2_14: UniversalBoard (P2.14), output_header (P3.12)
NetP2_15: UniversalBoard (P2.15), output_header (P3.46)
NetP2_16: UniversalBoard (P2.16), output_header (P3.11)
NetP2_17: UniversalBoard (P2.17), output_header (P3.8)
NetP2_18: UniversalBoard (P2.18), output_header (P3.42)
NetP2_28: UniversalBoard (P2.28), 5vOutputs (U7.3)
NetP2_36: UniversalBoard (P2.36), 12vOutputs (U3.3)
NetP2_37: UniversalBoard (P2.37), 12vOutputs (U2.5)
NetP2_38: UniversalBoard (P2.38), 12vOutputs (U2.3)
NetP2_44: UniversalBoard (P2.44), DAC_PWW_Outputs (U10.3)
NetP2_45: UniversalBoard (P2.45), 12vOutputs (U1.5)
NetP2_46: UniversalBoard (P2.46), 12vOutputs (U1.3)
NetP2_47: UniversalBoard (P2.47), 5vOutputs (U6.5)
NetP2_48: UniversalBoard (P2.48), 5vOutputs (U6.4)
NetP3_2: 12vOutputs (U1.9 U1.10), output_header (P3.2)
NetP3_3: 12vOutputs (U2.9 U2.10), output_header (P3.3)
NetP3_4: 12vOutputs (U3.9 U3.10), output_header (P3.4)
NetP3_5: 12vOutputs (U4.9 U4.10), output_header (P3.5)
NetP3_6: 12vOutputs (U5.9 U5.10), output_header (P3.6)
NetP3_16: output_header (P3.16), 5vOutputs (U6.12)
NetP3_17: output_header (P3.17), 5vOutputs (U6.10)
NetP3_18: output_header (P3.18), 5vOutputs (U7.12)
NetP3_20: output_header (P3.20), Analog_inputs (R18.2)
NetP3_21: output_header (P3.21), Analog_inputs (R14.2)
NetP3_26: output_header (P3.26), DAC_PWW_Outputs (R5.1 U10.1)
NetP3_28: output_header (P3.28), DAC_PWW_Outputs (R4.1 U9.1)
NetP3_36: 12vOutputs (U1.12 U1.13), output_header (P3.36)
NetP3_37: 12vOutputs (U2.12 U2.13), output_header (P3.37)
NetP3_38: 12vOutputs (U3.12 U3.13), output_header (P3.38)
NetP3_39: 12vOutputs (U4.12 U4.13), output_header (P3.39)
NetP3_40: 12vOutputs (U5.12 U5.13), output_header (P3.40)
NetP3_50: output_header (P3.50), 5vOutputs (U6.13)
NetP3_51: output_header (P3.51), 5vOutputs (U6.11)
NetP3_52: output_header (P3.52), 5vOutputs (U7.13)
NetP3_53: output_header (P3.53), 5vOutputs (U7.11)
NetP3_55: output_header (P3.55), Analog_inputs (R16.2)
NetP3_57: output_header (P3.57), Analog_inputs (R12.2)
NetP3_61: output_header (P3.61), DAC_PWW_Outputs (R8.1 U11.1)
NetP3_62: output_header (P3.62), DAC_PWW_Outputs (R1.1 U8.1)